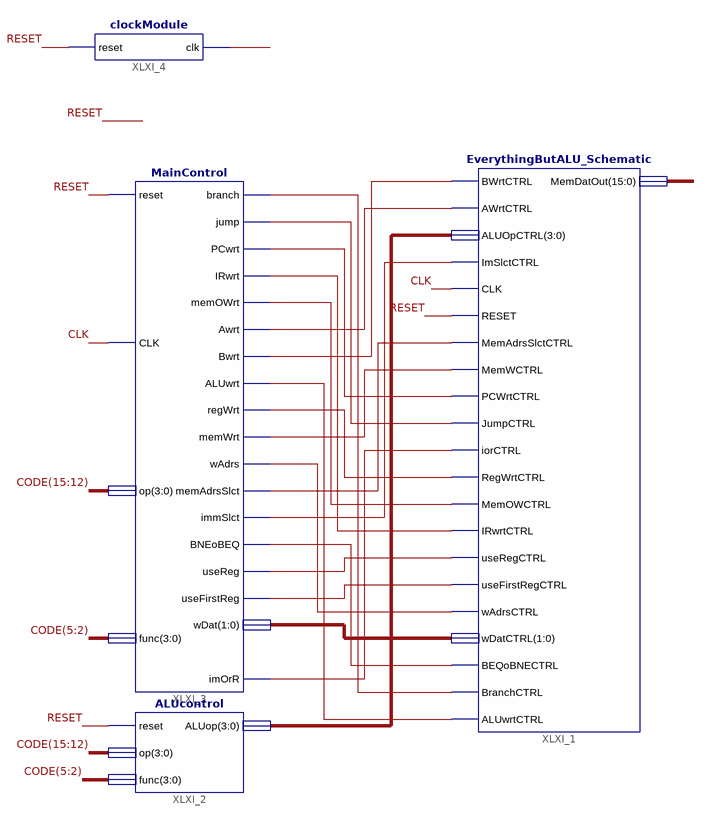
[diagram p0: schematic sheet 1]
// Xilinx ISE schematic Everything.sch (spartan3e) as structural Verilog: 4 symbols, 0 ports
module Everything (
);

  wire CLK, RESET, XLXN_1, XLXN_2, XLXN_3, XLXN_4, XLXN_5, XLXN_6, XLXN_7, XLXN_8, XLXN_9, XLXN_10, XLXN_11,
       XLXN_12, XLXN_13, XLXN_14, XLXN_15, XLXN_16, XLXN_18;
  wire [1:0] XLXN_17;
  wire [3:0] XLXN_19;
  wire [15:0] CODE;

  EverythingButALU_Schematic XLXI_1 (
    .BWrtCTRL(XLXN_7), .AWrtCTRL(XLXN_6), .ALUOpCTRL(XLXN_19), .ImSlctCTRL(XLXN_13), .CLK(CLK),
    .RESET(RESET), .MemAdrsSlctCTRL(XLXN_12), .MemWCTRL(XLXN_10), .PCWrtCTRL(XLXN_3), .JumpCTRL(XLXN_2),
    .iorCTRL(XLXN_18), .RegWrtCTRL(XLXN_9), .MemOWCTRL(XLXN_5), .IRwrtCTRL(XLXN_4), .useRegCTRL(XLXN_15),
    .useFirstRegCTRL(XLXN_16), .wAdrsCTRL(XLXN_11), .wDatCTRL(XLXN_17), .BEQoBNECTRL(XLXN_14),
    .BranchCTRL(XLXN_1), .ALUwrtCTRL(XLXN_8), .MemDatOut(CODE));
  ALUcontrol XLXI_2 (.reset(RESET), .op(CODE[15:12]), .func(CODE[5:2]), .ALUop(XLXN_19));
  MainControl XLXI_3 (
    .reset(RESET), .CLK(CLK), .op(CODE[15:12]), .func(CODE[5:2]), .branch(XLXN_1), .jump(XLXN_2),
    .PCwrt(XLXN_3), .IRwrt(XLXN_4), .memOWrt(XLXN_5), .Awrt(XLXN_6), .Bwrt(XLXN_7), .ALUwrt(XLXN_8),
    .regWrt(XLXN_9), .memWrt(XLXN_10), .wAdrs(XLXN_11), .memAdrsSlct(XLXN_12), .immSlct(XLXN_13),
    .BNEoBEQ(XLXN_14), .useReg(XLXN_15), .useFirstReg(XLXN_16), .wDat(XLXN_17), .imOrR(XLXN_18));
  clockModule XLXI_4 (.reset(RESET), .clk(CLK));
endmodule
